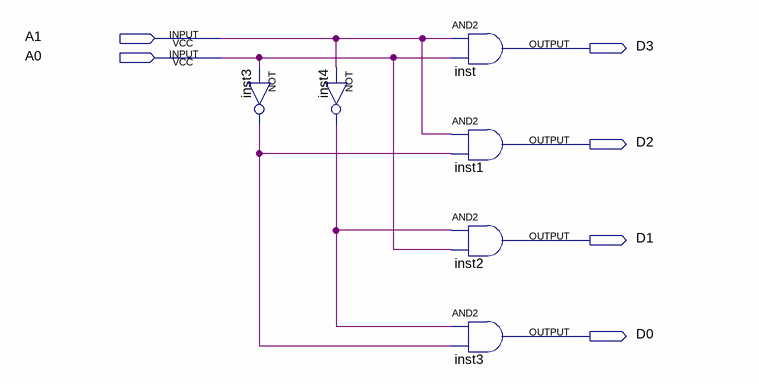
[diagram p0: schematic sheet]
// Quartus schematic dec.bdf as structural Verilog: 6 symbols, 6 pins
module dec (
  input  A1,
  input  A0,
  output D3,
  output D2,
  output D1,
  output D0
);

  wire inst3_out, inst4_out;

  not inst3 (inst3_out, A0);
  not inst4 (inst4_out, A1);
  and inst (D3, A1, A0);
  and inst1 (D2, A1, inst3_out);
  and inst2 (D1, inst4_out, A0);
  and inst3_dup2 (D0, inst4_out, inst3_out);
endmodule
